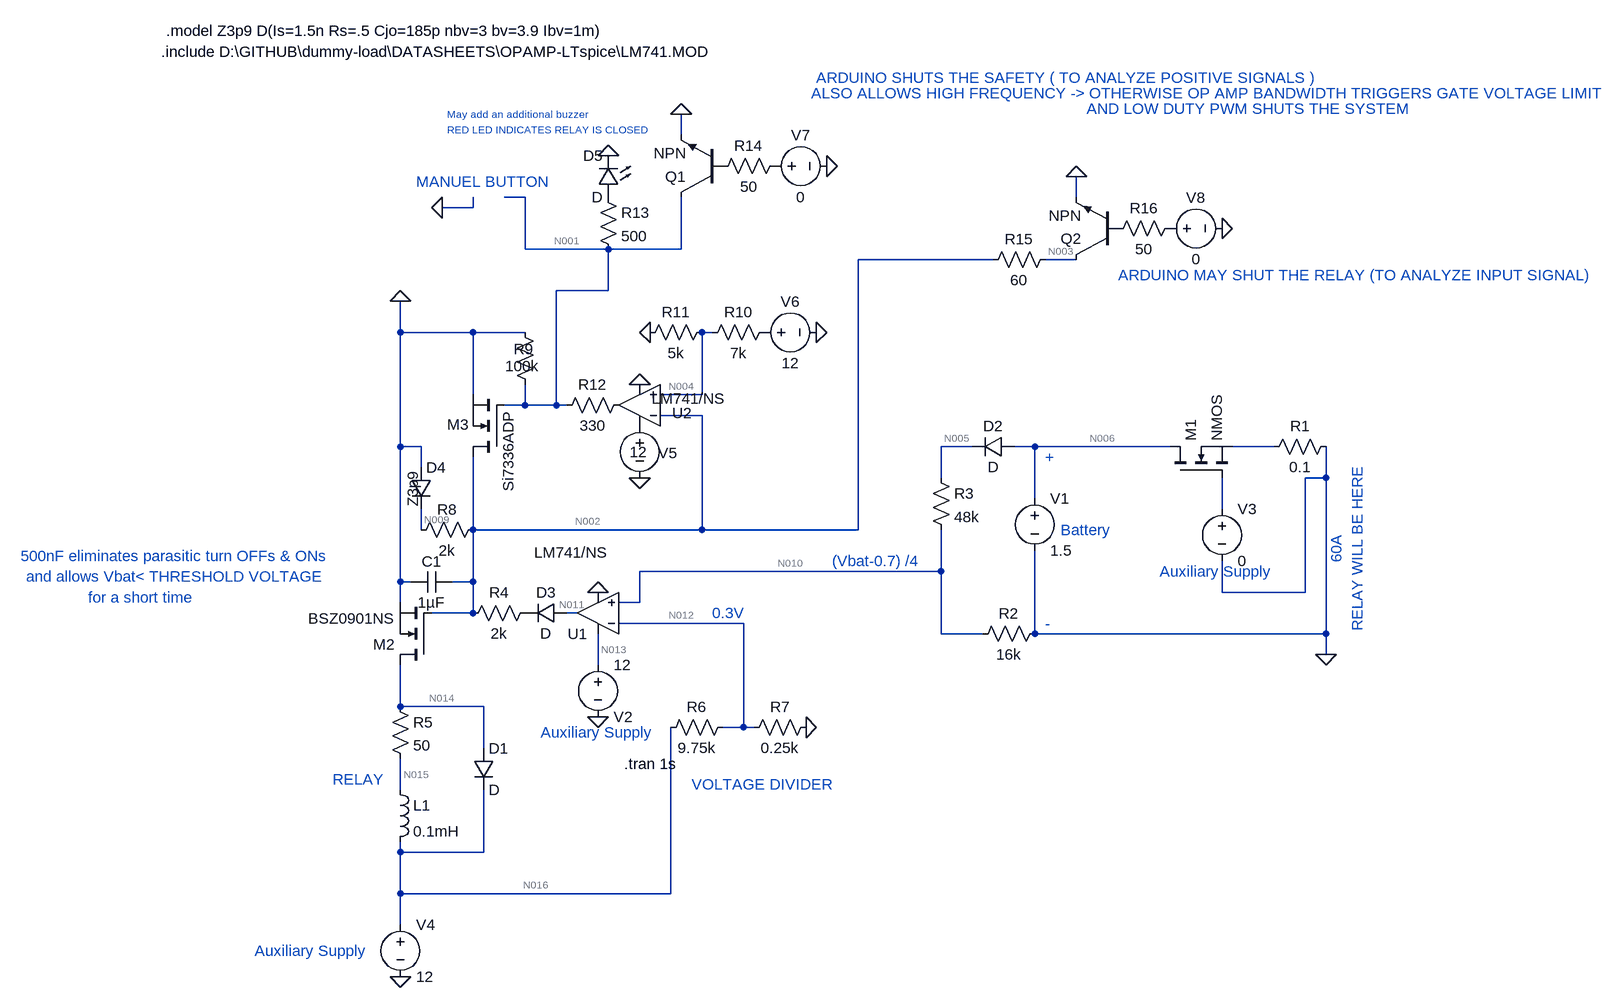
[diagram p0: schematic FINISHED REVERSE VOLTAGE PROTECTION WITH RELAY.asc]
FINISHED REVERSE VOLTAGE PROTECTION WITH RELAY.asc, the LTspice schematic file:
Version 4
SHEET 1 972 708
WIRE -608 -608 -608 -640
WIRE -848 -512 -880 -512
WIRE 0 -512 0 -544
WIRE -928 -496 -928 -512
WIRE -928 -496 -976 -496
WIRE -848 -432 -848 -512
WIRE -720 -432 -848 -432
WIRE -608 -432 -608 -512
WIRE -608 -432 -720 -432
WIRE -128 -416 -336 -416
WIRE 0 -416 -48 -416
WIRE -720 -368 -720 -432
WIRE -720 -368 -800 -368
WIRE -1040 -304 -1040 -352
WIRE -928 -304 -1040 -304
WIRE -848 -304 -928 -304
WIRE -560 -304 -576 -304
WIRE -928 -208 -928 -304
WIRE -576 -208 -576 -304
WIRE -576 -208 -640 -208
WIRE -848 -192 -848 -224
WIRE -848 -192 -880 -192
WIRE -800 -192 -800 -368
WIRE -800 -192 -848 -192
WIRE -784 -192 -800 -192
WIRE -576 -176 -640 -176
WIRE -1040 -128 -1040 -304
WIRE -1008 -128 -1040 -128
WIRE -160 -128 -208 -128
WIRE -64 -128 -96 -128
WIRE 144 -128 -64 -128
WIRE 304 -128 240 -128
WIRE -1008 -96 -1008 -128
WIRE -208 -80 -208 -128
WIRE 384 -80 384 -128
WIRE 384 -80 352 -80
WIRE -64 -48 -64 -128
WIRE 224 -32 224 -80
WIRE -1008 0 -1008 -32
WIRE -928 0 -928 -112
WIRE -576 0 -576 -176
WIRE -576 0 -928 0
WIRE -336 0 -336 -416
WIRE -336 0 -576 0
WIRE -208 64 -208 0
WIRE -208 64 -672 64
WIRE -1040 80 -1040 -128
WIRE -1024 80 -1040 80
WIRE -928 80 -928 0
WIRE -928 80 -960 80
WIRE 224 96 224 48
WIRE 352 96 352 -80
WIRE 352 96 224 96
WIRE -1040 112 -1040 80
WIRE -672 112 -672 64
WIRE -672 112 -704 112
WIRE -928 128 -928 80
WIRE -928 128 -992 128
WIRE -768 128 -784 128
WIRE -512 144 -704 144
WIRE -208 160 -208 64
WIRE -144 160 -208 160
WIRE -64 160 -64 32
WIRE 384 160 384 -80
WIRE 384 160 -64 160
WIRE 384 192 384 160
WIRE -736 208 -736 160
WIRE -1040 272 -1040 208
WIRE -912 272 -1040 272
WIRE -512 304 -512 144
WIRE -512 304 -544 304
WIRE -496 304 -512 304
WIRE -912 336 -912 272
WIRE -1040 400 -1040 352
WIRE -1040 496 -1040 480
WIRE -912 496 -912 400
WIRE -912 496 -1040 496
WIRE -1040 560 -1040 496
WIRE -624 560 -624 304
WIRE -624 560 -1040 560
WIRE -1040 608 -1040 560
FLAG 384 192 0
FLAG -736 96 0
FLAG -736 288 0
FLAG -1040 688 0
FLAG -416 304 0
FLAG -1040 -352 0
FLAG -672 -224 0
FLAG -672 -80 0
FLAG -400 -304 0
FLAG -656 -304 0
FLAG -720 -576 0
FLAG -976 -496 0
FLAG -608 -640 0
FLAG -384 -560 0
FLAG 0 -544 0
FLAG 224 -464 0
SYMBOL res 400 -144 R90
WINDOW 0 0 56 VBottom 2
WINDOW 3 32 56 VTop 2
SYMATTR InstName R1
SYMATTR Value 0.1
SYMBOL OpAmps\\opamp2 -736 192 R180
WINDOW 3 -16 157 Left 2
SYMATTR Value LM741/NS
SYMATTR InstName U1
SYMBOL voltage -736 192 R0
WINDOW 0 24 96 Left 2
WINDOW 3 24 16 Left 2
WINDOW 123 0 0 Left 0
WINDOW 39 0 0 Left 0
SYMATTR InstName V2
SYMATTR Value 12
SYMBOL res -48 144 R90
WINDOW 0 0 56 VBottom 2
WINDOW 3 32 56 VTop 2
SYMATTR InstName R2
SYMATTR Value 16k
SYMBOL voltage -64 -64 R0
WINDOW 123 0 0 Left 0
WINDOW 39 0 0 Left 0
SYMATTR InstName V1
SYMATTR Value 1.5
SYMBOL nmos 144 -80 R270
SYMATTR InstName M1
SYMBOL diode -96 -144 R90
WINDOW 0 0 32 VBottom 2
WINDOW 3 32 32 VTop 2
SYMATTR InstName D2
SYMBOL res -224 -96 R0
SYMATTR InstName R3
SYMATTR Value 48k
SYMBOL nmos -992 208 R180
SYMATTR InstName M2
SYMATTR Value BSZ0901NS
SYMBOL res -1056 256 R0
SYMATTR InstName R5
SYMATTR Value 50
SYMBOL ind -1056 384 R0
SYMATTR InstName L1
SYMATTR Value 0.1mH
SYMBOL voltage -1040 592 R0
WINDOW 123 0 0 Left 0
WINDOW 39 0 0 Left 0
SYMATTR InstName V4
SYMATTR Value 12
SYMBOL diode -928 336 R0
SYMATTR InstName D1
SYMBOL res -528 288 R90
WINDOW 0 0 56 VBottom 2
WINDOW 3 32 56 VTop 2
SYMATTR InstName R6
SYMATTR Value 9.75k
SYMBOL res -400 288 R90
WINDOW 0 0 56 VBottom 2
WINDOW 3 32 56 VTop 2
SYMATTR InstName R7
SYMATTR Value 0.25k
SYMBOL voltage 224 -48 R0
WINDOW 123 0 0 Left 0
WINDOW 39 0 0 Left 0
SYMATTR InstName V3
SYMATTR Value 0
SYMBOL res -832 112 R90
WINDOW 0 0 56 VBottom 2
WINDOW 3 32 56 VTop 2
SYMATTR InstName R4
SYMATTR Value 2k
SYMBOL nmos -880 -112 R180
WINDOW 0 54 50 Left 2
WINDOW 3 -6 70 VLeft 2
SYMATTR InstName M3
SYMATTR Value Si7336ADP
SYMBOL res -864 -320 R0
WINDOW 0 -2 42 Left 2
WINDOW 3 -15 68 Left 2
SYMATTR InstName R9
SYMATTR Value 100k
SYMBOL OpAmps\\opamp2 -672 -128 R180
WINDOW 0 -81 52 Left 2
WINDOW 3 -133 74 Left 2
SYMATTR InstName U2
SYMATTR Value LM741/NS
SYMBOL voltage -672 -176 R0
WINDOW 0 29 58 Left 2
WINDOW 3 -15 56 Left 2
WINDOW 123 0 0 Left 0
WINDOW 39 0 0 Left 0
SYMATTR InstName V5
SYMATTR Value 12
SYMBOL voltage -496 -304 R270
WINDOW 0 32 56 VTop 2
WINDOW 3 -32 56 VBottom 2
WINDOW 123 0 0 Left 0
WINDOW 39 0 0 Left 0
SYMATTR InstName V6
SYMATTR Value 12
SYMBOL res -464 -320 R90
WINDOW 0 0 56 VBottom 2
WINDOW 3 32 56 VTop 2
SYMATTR InstName R10
SYMATTR Value 7k
SYMBOL res -560 -320 R90
WINDOW 0 0 56 VBottom 2
WINDOW 3 32 56 VTop 2
SYMATTR InstName R11
SYMATTR Value 5k
SYMBOL res -688 -208 R90
WINDOW 0 0 56 VBottom 2
WINDOW 3 32 56 VTop 2
SYMATTR InstName R12
SYMATTR Value 330
SYMBOL LED -704 -512 R180
WINDOW 0 24 64 Left 2
WINDOW 3 24 0 Left 2
SYMATTR InstName D5
SYMBOL res -736 -528 R0
SYMATTR InstName R13
SYMATTR Value 500
SYMBOL npn -544 -512 R180
SYMATTR InstName Q1
SYMBOL res -448 -576 R90
WINDOW 0 0 56 VBottom 2
WINDOW 3 32 56 VTop 2
SYMATTR InstName R14
SYMATTR Value 50
SYMBOL voltage -480 -560 R270
WINDOW 0 32 56 VTop 2
WINDOW 3 -32 56 VBottom 2
WINDOW 123 0 0 Left 0
WINDOW 39 0 0 Left 0
SYMATTR InstName V7
SYMATTR Value 0
SYMBOL npn 64 -416 R180
SYMATTR InstName Q2
SYMBOL res -32 -432 R90
WINDOW 0 0 56 VBottom 2
WINDOW 3 32 56 VTop 2
SYMATTR InstName R15
SYMATTR Value 60
SYMBOL res 160 -480 R90
WINDOW 0 0 56 VBottom 2
WINDOW 3 32 56 VTop 2
SYMATTR InstName R16
SYMATTR Value 50
SYMBOL voltage 128 -464 R270
WINDOW 0 32 56 VTop 2
WINDOW 3 -32 56 VBottom 2
WINDOW 123 0 0 Left 0
WINDOW 39 0 0 Left 0
SYMATTR InstName V8
SYMATTR Value 0
SYMBOL cap -960 64 R90
WINDOW 0 0 32 VBottom 2
WINDOW 3 32 32 VTop 2
SYMATTR InstName C1
SYMATTR Value 1µF
SYMATTR SpiceLine IC=7
SYMBOL diode -784 112 R90
WINDOW 0 0 32 VBottom 2
WINDOW 3 32 32 VTop 2
SYMATTR InstName D3
SYMBOL diode -1024 -96 R0
WINDOW 3 3 60 VLeft 2
SYMATTR InstName D4
SYMATTR Value Z3p9
SYMBOL res -912 -16 R90
WINDOW 0 0 56 VBottom 2
WINDOW 3 32 56 VTop 2
SYMATTR InstName R8
SYMATTR Value 2k
TEXT -696 360 Left 2 !.tran 1s
TEXT -1408 -736 Left 2 !.include D:\\GITHUB\\dummy-load\\DATASHEETS\\OPAMP-LTspice\\LM741.MOD
TEXT 432 -96 VRight 2 ;RELAY WILL BE HERE
TEXT 400 8 VRight 2 ;60A
TEXT -1144 384 Left 2 ;RELAY
TEXT -592 392 Left 2 ;VOLTAGE DIVIDER
TEXT -1624 40 Left 2 ;500nF eliminates parasitic turn OFFs & ONs
TEXT -1616 72 Left 2 ;and allows Vbat< THRESHOLD VOLTAGE
TEXT -1264 648 Left 2 ;Auxiliary Supply
TEXT 128 64 Left 2 ;Auxiliary Supply
TEXT -24 0 Left 2 ;Battery
TEXT -48 -112 Left 2 ;+
TEXT -48 144 Left 2 ;-
TEXT -376 48 Left 2 ;(Vbat-0.7) /4
TEXT -560 128 Left 2 ;0.3V
TEXT -1520 104 Left 2 ;for a short time
TEXT -824 312 Left 2 ;Auxiliary Supply
TEXT -1016 -536 Left 2 ;MANUEL BUTTON
TEXT -400 -696 Left 2 ;ARDUINO SHUTS THE SAFETY ( TO ANALYZE POSITIVE SIGNALS )
TEXT -968 -616 Left 1 ;RED LED INDICATES RELAY IS CLOSED
TEXT 64 -392 Left 2 ;ARDUINO MAY SHUT THE RELAY (TO ANALYZE INPUT SIGNAL)
TEXT -408 -672 Left 2 ;ALSO ALLOWS HIGH FREQUENCY -> OTHERWISE OP AMP BANDWIDTH TRIGGERS GATE VOLTAGE LIMIT
TEXT -1400 -768 Left 2 !.model Z3p9 D(Is=1.5n Rs=.5 Cjo=185p nbv=3 bv=3.9 Ibv=1m)
TEXT -968 -640 Left 1 ;May add an additional buzzer
TEXT 16 -648 Left 2 ;AND LOW DUTY PWM SHUTS THE SYSTEM

The netlist it stands for:
* FINISHED REVERSE VOLTAGE PROTECTION WITH RELAY.asc
R1 0 N007 0.1
XU1 N010 N012 N013 0 N011 LM741/NS  ; pins In+ In- V+ V- OUT
V2 N013 0 12
R2 0 N010 16k
V1 N006 0 1.5
M1 N006 N008 N007 N007 NMOS
D2 N006 N005 D
R3 N005 N010 48k
M2 N014 N002 0 0 BSZ0901NS
R5 N014 N015 50
L1 N015 N016 0.1mH
V4 N016 0 12
D1 N014 N016 D
R6 N012 N016 9.75k
R7 0 N012 0.25k
V3 N008 0 0
R4 P001 N002 2k
M3 N002 N001 0 0 Si7336ADP
R9 0 N001 100k
XU2 N004 N002 P002 0 P003 LM741/NS  ; pins In+ In- V+ V- OUT
V5 P002 0 12
V6 P004 0 12
R10 P004 N004 7k
R11 N004 0 5k
R12 P003 N001 330
D5 P005 0 D
R13 P005 N001 500
Q1 N001 P006 0 0 NPN
R14 P007 P006 50
V7 P007 0 0
Q2 N003 P008 0 0 NPN
R15 N003 N002 60
R16 P009 P008 50
V8 P009 0 0
C1 N002 0 1µF IC=7
D3 N011 P001 D
D4 0 N009 Z3p9
R8 N002 N009 2k
.model D D
.lib standard.dio
.model NPN NPN
.model PNP PNP
.lib standard.bjt
.model NMOS NMOS
.model PMOS PMOS
.lib standard.mos
.tran 1s
.include D:\GITHUB\dummy-load\DATASHEETS\OPAMP-LTspice\LM741.MOD
* RELAY WILL BE HERE
* 60A
* RELAY
* VOLTAGE DIVIDER
* 500nF eliminates parasitic turn OFFs & ONs
* and allows Vbat< THRESHOLD VOLTAGE
* Auxiliary Supply
* Auxiliary Supply
* Battery
* +
* -
* (Vbat-0.7) /4
* 0.3V
* for a short time
* Auxiliary Supply
* MANUEL BUTTON
* ARDUINO SHUTS THE SAFETY ( TO ANALYZE POSITIVE SIGNALS )
* RED LED INDICATES RELAY IS CLOSED
* ARDUINO MAY SHUT THE RELAY (TO ANALYZE INPUT SIGNAL)
* ALSO ALLOWS HIGH FREQUENCY -> OTHERWISE OP AMP BANDWIDTH TRIGGERS GATE VOLTAGE LIMIT
.model Z3p9 D(Is=1.5n Rs=.5 Cjo=185p nbv=3 bv=3.9 Ibv=1m)
* May add an additional buzzer
* AND LOW DUTY PWM SHUTS THE SYSTEM
.backanno
.end

* Results of the author's LTspice run, read from the files saved beside the schematic
* Operating Point, zero values left out:
*   V(n012) = 299.9 mV
*   V(n010) = 239.9 mV
*   V(n013) = 12 V
*   V(n011) = 978.1 mV
*   V(n006) = 1.5 V
*   V(n005) = 953.7 mV
*   V(n014) = 419.7 µV
*   V(n002) = 7 V
*   V(n015) = 12 V
*   V(n016) = 12 V
*   V(p001) = 7 V
*   V(n001) = 804.9 mV
*   V(n004) = 5.012 V
*   V(p002) = 12 V
*   V(p003) = 924.2 mV
*   V(p004) = 12 V
*   V(p005) = 628.2 mV
*   V(n003) = 7 V
*   V(n009) = 3.934 V
*   Ic(Q2) = 7 pA
*   Ib(Q2) = -7 pA
*   Id(M1) = 3.01 pA
*   Ib(M1) = -1.51 pA
*   Is(M1) = -1.5 pA
*   Id(M3) = 12.14 pA
*   Is(M3) = -12.14 pA
*   Id(M2) = 240 mA
*   Is(M2) = -240 mA
*   I(C1) = -1.537 mA
*   I(D4) = -1.533 mA
*   I(D3) = -6.032 pA
*   I(D5) = 353.4 µA
*   I(D1) = -12.01 pA
*   I(D2) = 14.87 µA
*   I(L1) = -240 mA
*   I(R8) = 1.533 mA
*   I(R16) = -7 pA
*   I(R15) = -7 pA
*   I(R13) = -353.4 µA
*   I(R12) = 361.5 µA
*   I(R11) = 1.002 mA
*   I(R10) = 998.3 µA
*   I(R9) = -8.049 µA
*   I(R4) = -6.032 pA
*   I(R7) = -1.2 mA
*   I(R6) = -1.2 mA
*   I(R5) = -240 mA
*   I(R3) = 14.87 µA
*   I(R2) = -15 µA
*   I(R1) = -3.01 pA
*   I(V8) = 7 pA
*   I(V6) = -998.3 µA
*   I(V5) = -1.665 mA
*   I(V4) = -241.2 mA
*   I(V1) = -14.87 µA
*   I(V2) = -1.388 mA
*   Ix(u1:1) = -125.3 nA
*   Ix(u1:2) = 285 nA
*   Ix(u1:99) = 1.388 mA
*   Ix(u1:50) = -1.388 mA
*   Ix(u1:28) = 5.995 pA
*   Ix(u2:1) = -3.997 µA
*   Ix(u2:2) = 4.156 µA
*   Ix(u2:99) = 1.665 mA
*   Ix(u2:50) = -1.304 mA
*   Ix(u2:28) = -361.5 µA
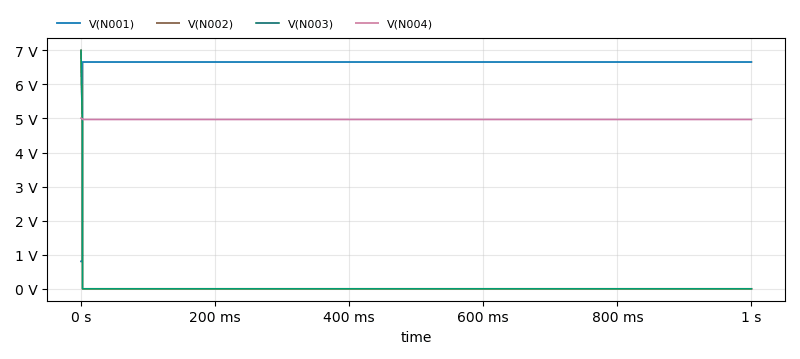
[diagram p1: Transient Analysis of FINISHED REVERSE VOLTAGE PROTECTION WITH RELAY.asc, plotted from the saved traces]
* Transient Analysis, 1 run:
*   V(N001): min 804.8 mV, max 6.658 V, average 6.646 V, rms 6.651 V, last 6.658 V
*   V(N002): min 0 V, max 7 V, average 12.29 mV, rms 269.2 mV, last 0 V
*   V(N003): min 0 V, max 7 V, average 12.29 mV, rms 269.2 mV, last 0 V
*   V(N004): min 4.971 V, max 5.012 V, average 4.971 V, rms 4.971 V, last 4.971 V